# EAGLE schematic MD201x_2019-02-01 (EAGLE 9.4.2)

## Sheet 1 of 4
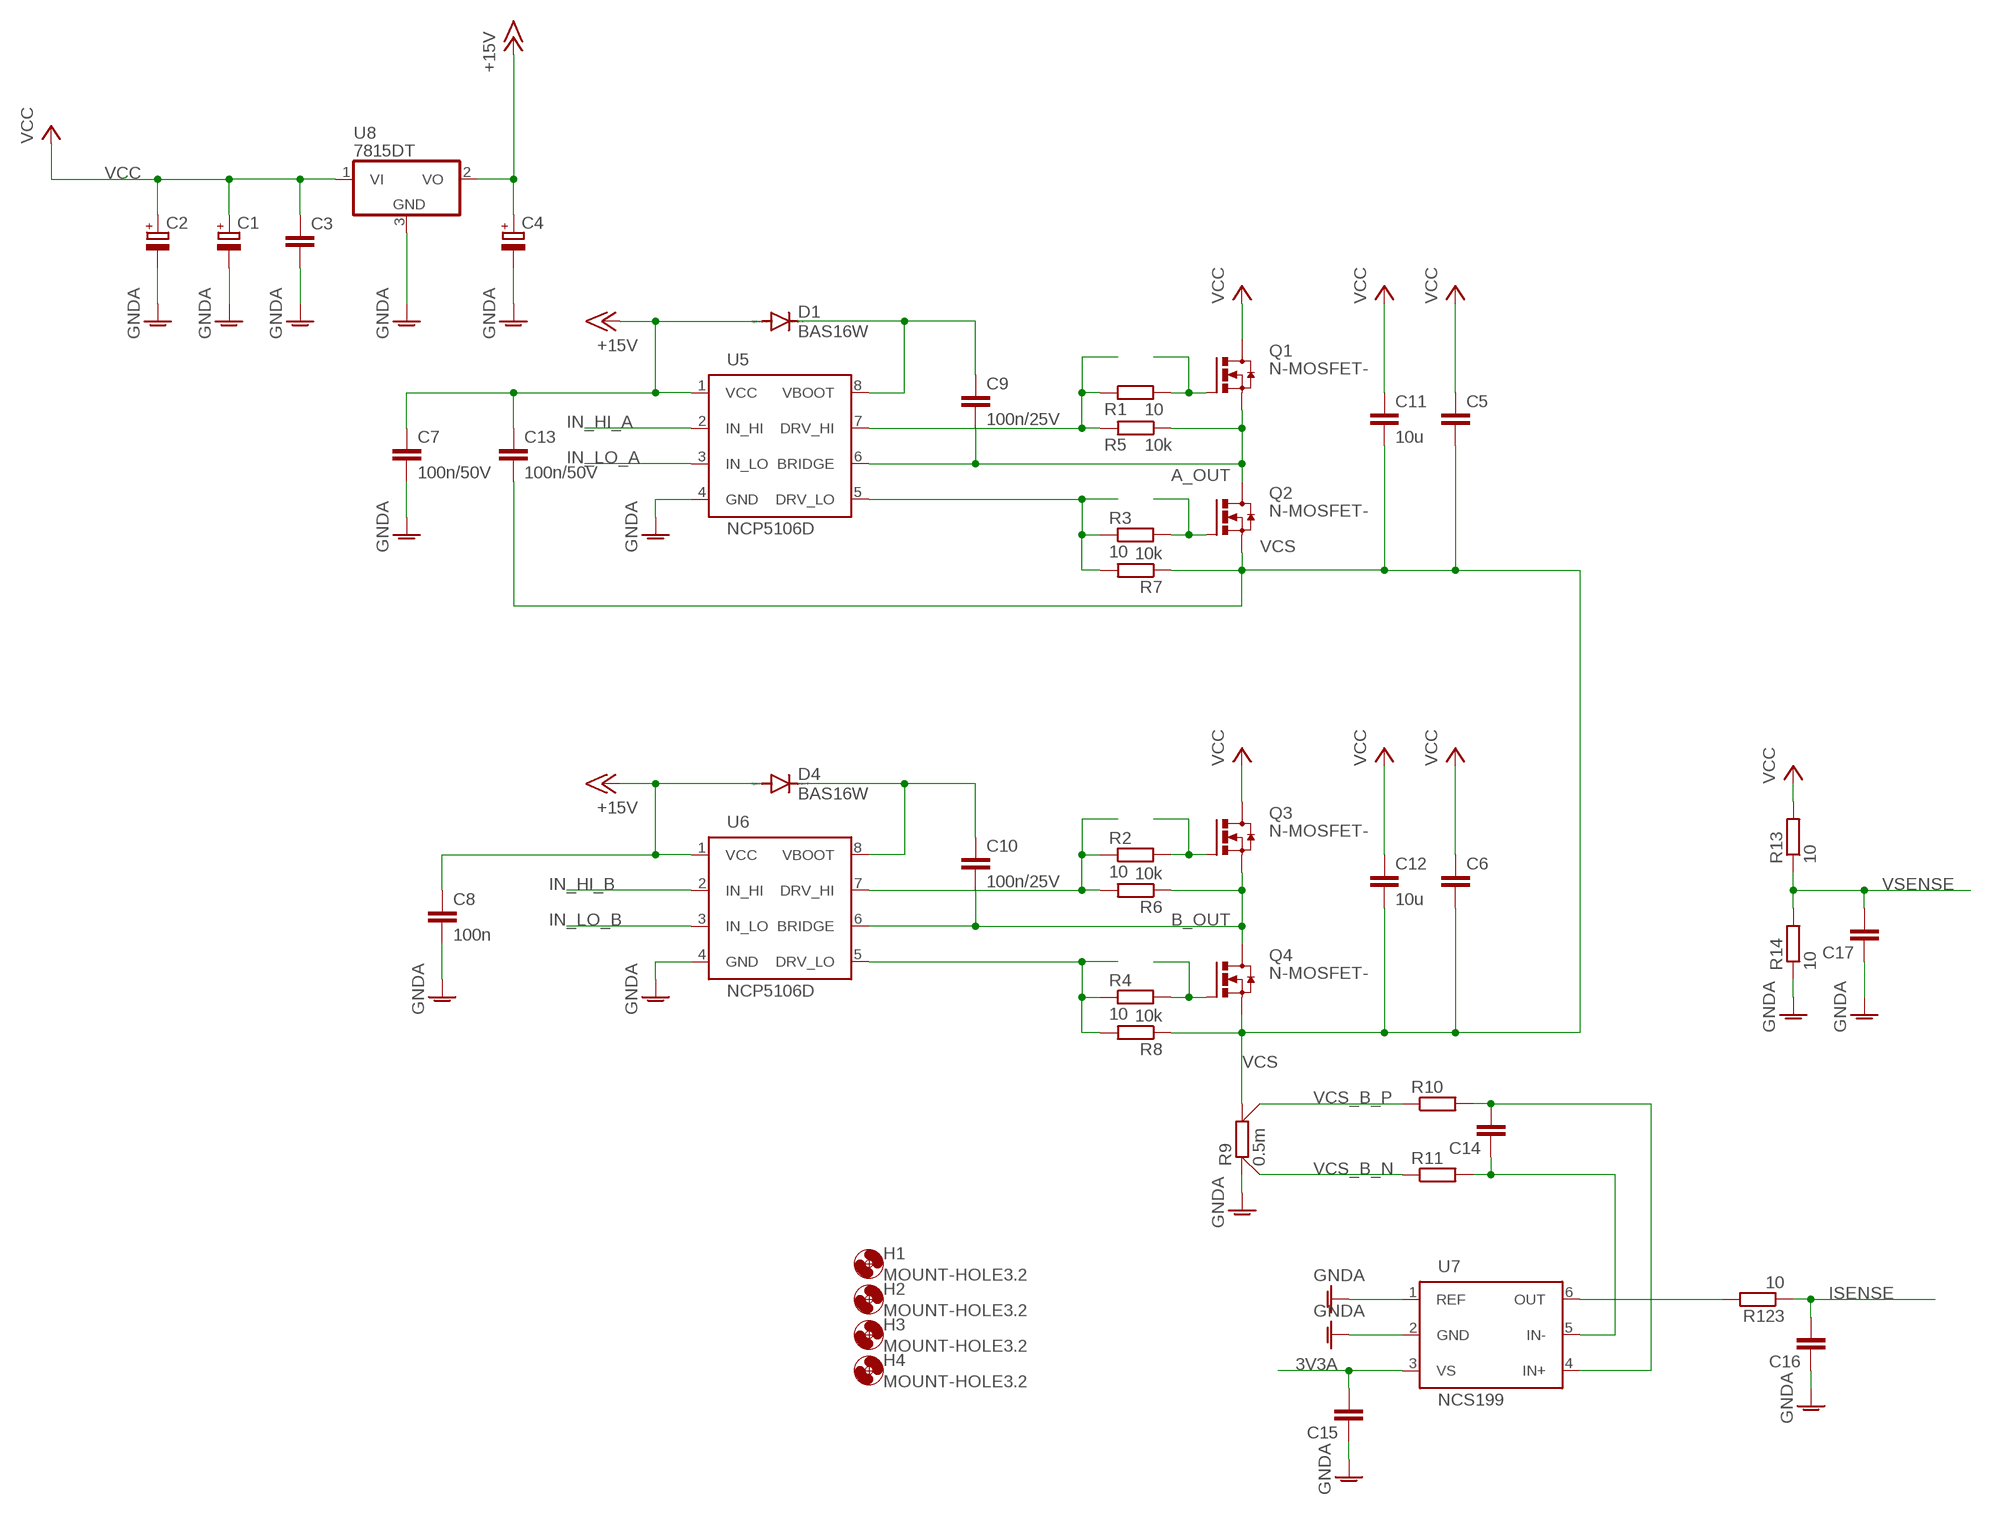
[diagram p0: schematic, sheet 1]

### Parts
C1  CPOL-EUE5-10.5  [E5-10,5]
C2  CPOL-EUE5-10.5  [E5-10,5]
C3  C-EUC0603  [C0603]
C4  CPOL-EUE2.5-5  [E2,5-5]
C5  C-EUC0603  [C0603]
C6  C-EUC0603  [C0603]
C7  100n/50V  C-EUC0603  [C0603]
C8  100n  C-EUC0603  [C0603]
C9  100n/25V  C-EUC0603  [C0603]
C10  100n/25V  C-EUC0603  [C0603]
C11  10u  C-EUC1210  [C1210]
C12  10u  C-EUC1210  [C1210]
C13  100n/50V  C-EUC0603  [C0603]
C14  C-EUC0603  [C0603]
C15  C-EUC0603  [C0603]
C16  C-EUC0603  [C0603]
C17  C-EUC0603  [C0603]
D1  BAS16W  DIODE-SOD323-R  [SOD323-R]
D4  BAS16W  DIODE-SOD323-R  [SOD323-R]
H1  MOUNT-HOLE3.2  [3,2]
H2  MOUNT-HOLE3.2  [3,2]
H3  MOUNT-HOLE3.2  [3,2]
H4  MOUNT-HOLE3.2  [3,2]
Q1  N-MOSFET-  [SOT669]
Q2  N-MOSFET-  [SOT669]
Q3  N-MOSFET-  [SOT669]
Q4  N-MOSFET-  [SOT669]
R1  10  R-EU_R0603  [R0603]
R2  10  R-EU_R0603  [R0603]
R3  10  R-EU_R0603  [R0603]
R4  10  R-EU_R0603  [R0603]
R5  10k  R-EU_R0603  [R0603]
R6  10k  R-EU_R0603  [R0603]
R7  10k  R-EU_R0603  [R0603]
R8  10k  R-EU_R0603  [R0603]
R9  0.5m  CSS2H-2512  [CSS2H-2512]
R10  R-EU_R0603  [R0603]
R11  R-EU_R0603  [R0603]
R13  10  R-EU_R0603  [R0603]
R14  10  R-EU_R0603  [R0603]
R123  10  R-EU_R0603  [R0603]
U5  NCP5106D  [SOIC127P600X175-8]
U6  NCP5106D  [SOIC127P600X175-8]
U7  NCS199  [SOT65P210X110-6]
U8  7815DT  [TO252]

### Nets
3V3A: C15.2 U7.3(VS) ; also sheet 3
+15V: C4.+ C7.1 C8.1 C13.1 D1.A D4.A U5.1(VCC) U6.1(VCC) U8.2(VO) ; also sheet 4
A_OUT: C9.2 Q1.1(SOURCE) Q1.2(SOURCE) Q1.3(SOURCE) Q2.5(DRAIN) R5.1 U5.6(BRIDGE)
B_OUT: C10.2 Q3.1(SOURCE) Q3.2(SOURCE) Q3.3(SOURCE) Q4.5(DRAIN) R6.1 U6.6(BRIDGE)
GNDA: C1.- C2.- C3.2 C4.- C7.2 C8.2 C15.1 C16.1 C17.1 R9.1$1 R9.1$2 R14.1 U5.4(GND) U6.4(GND) U7.1(REF) U7.2(GND) U8.3(GND) ; also sheet 2,3,4
IN_HI_A: U5.2(IN_HI) ; also sheet 3
IN_HI_B: U6.2(IN_HI) ; also sheet 3
IN_LO_A: U5.3(IN_LO) ; also sheet 3
IN_LO_B: U6.3(IN_LO) ; also sheet 3
ISENSE: C16.2 R123.1 ; also sheet 3
N$1: R1.1 R5.2 U5.7(DRV_HI)
N$2: R2.1 R6.2 U6.7(DRV_HI)
N$4: Q1.4(GATE) R1.2
N$5: R4.1 R8.2 U6.5(DRV_LO)
N$6: R123.2 U7.6(OUT)
N$11: R3.1 R7.2 U5.5(DRV_LO)
N$13: Q3.4(GATE) R2.2
N$36: C14.2 R10.2 U7.4(IN+)
N$37: C14.1 R11.2 U7.5(IN-)
N$61: Q2.4(GATE) R3.2
N$64: Q4.4(GATE) R4.2
N$67: C10.1 D4.C U6.8(VBOOT)
N$73: C9.1 D1.C U5.8(VBOOT)
VCC: C1.+ C2.+ C3.1 C5.1 C6.1 C11.1 C12.1 Q1.5(DRAIN) Q3.5(DRAIN) R13.2 U8.1(VI)
VCS: C5.2 C6.2 C11.2 C12.2 C13.2 Q2.1(SOURCE) Q2.2(SOURCE) Q2.3(SOURCE) Q4.1(SOURCE) Q4.2(SOURCE) Q4.3(SOURCE) R7.1 R8.1 R9.2$1 R9.2$2
VCS_B_N: R9.1S R11.1
VCS_B_P: R9.2S R10.1
VSENSE: C17.2 R13.1 R14.2 ; also sheet 3

## Sheet 2 of 4
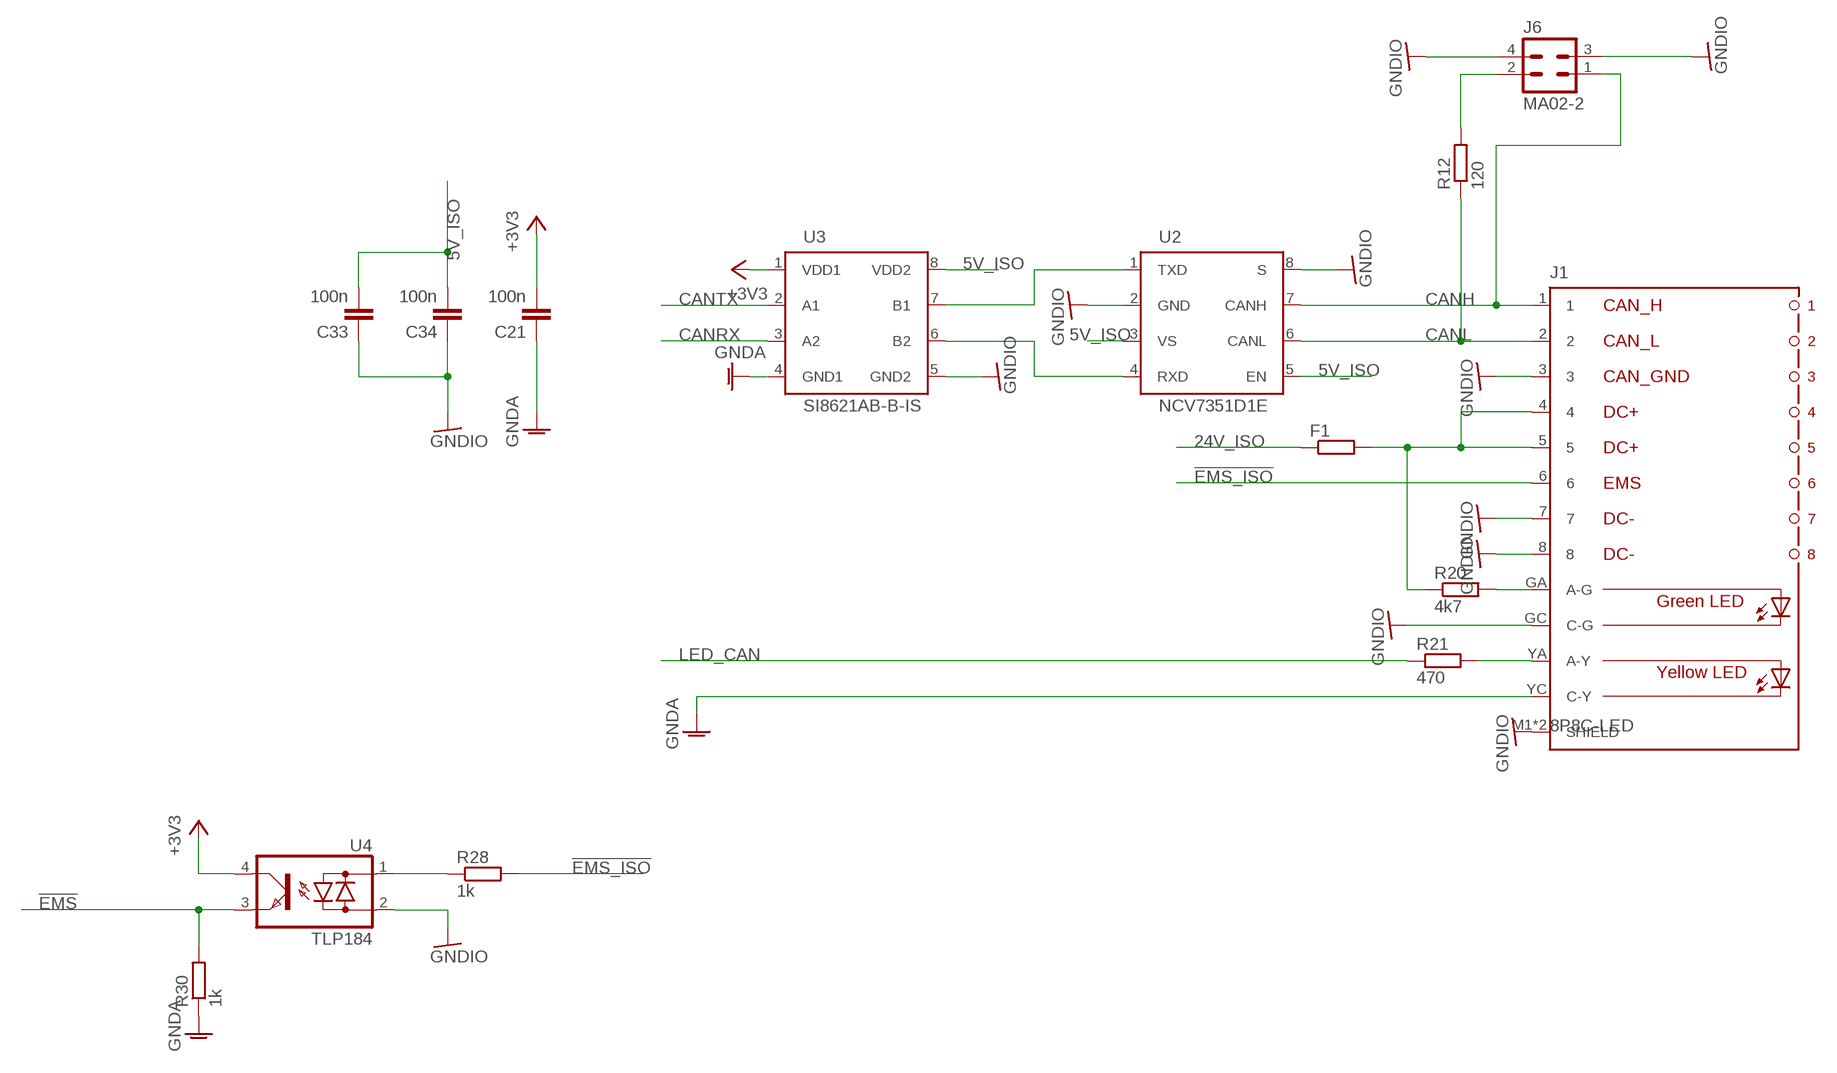
[diagram p1: schematic, sheet 2]

### Parts
C21  100n  C-EUC0603  [C0603]
C33  100n  C-EUC0805  [C0805]
C34  100n  C-EUC0603  [C0603]
F1  R-EU_R1206  [R1206]
J1  8P8C-LED  [8P8C-LED]
J6  MA02-2  [MA02-2W]
R12  120  R-EU_R0603  [R0603]
R20  4k7  R-EU_R0603  [R0603]
R21  470  R-EU_R0603  [R0603]
R28  1k  R-EU_R0603  [R0603]
R30  1k  R-EU_R0603  [R0603]
U2  NCV7351D1E  [SO08]
U3  SI8621AB-B-IS  [SO08]
U4  TLP184  [11-4M1S]

### Nets
5V_ISO: C33.2 C34.2 U2.3(VS) U2.5(EN) U3.8(VDD2) ; also sheet 4
24V_ISO: F1.1 ; also sheet 4
!EMS: R30.2 U4.3(E) ; also sheet 3
!EMS_ISO: J1.6 R28.2
+3V3: C21.2 U3.1(VDD1) U4.4(C) ; also sheet 3,4
CANH: J1.1 J6.1 U2.7(CANH)
CANL: J1.2 R12.1 U2.6(CANL)
CANRX: U3.3(A2) ; also sheet 3
CANTX: U3.2(A1) ; also sheet 3
GNDA: C21.1 J1.YC(C-Y) R30.1 U3.4(GND1) ; also sheet 1,3,4
GNDIO: C33.1 C34.1 J1.3 J1.7 J1.8 J1.GC(C-G) J1.M1(SHIELD) J1.M2(SHIELD) J6.3 J6.4 U2.2(GND) U2.8(S) U3.5(GND2) U4.2(AC2) ; also sheet 4
LED_CAN: R21.1 ; also sheet 3
N$8: F1.2 J1.4 J1.5 R20.1
N$9: J6.2 R12.2
N$18: J1.GA(A-G) R20.2
N$20: J1.YA(A-Y) R21.2
N$23: U2.1(TXD) U3.7(B1)
N$27: U2.4(RXD) U3.6(B2)
N$30: R28.1 U4.1(AC1)

## Sheet 3 of 4
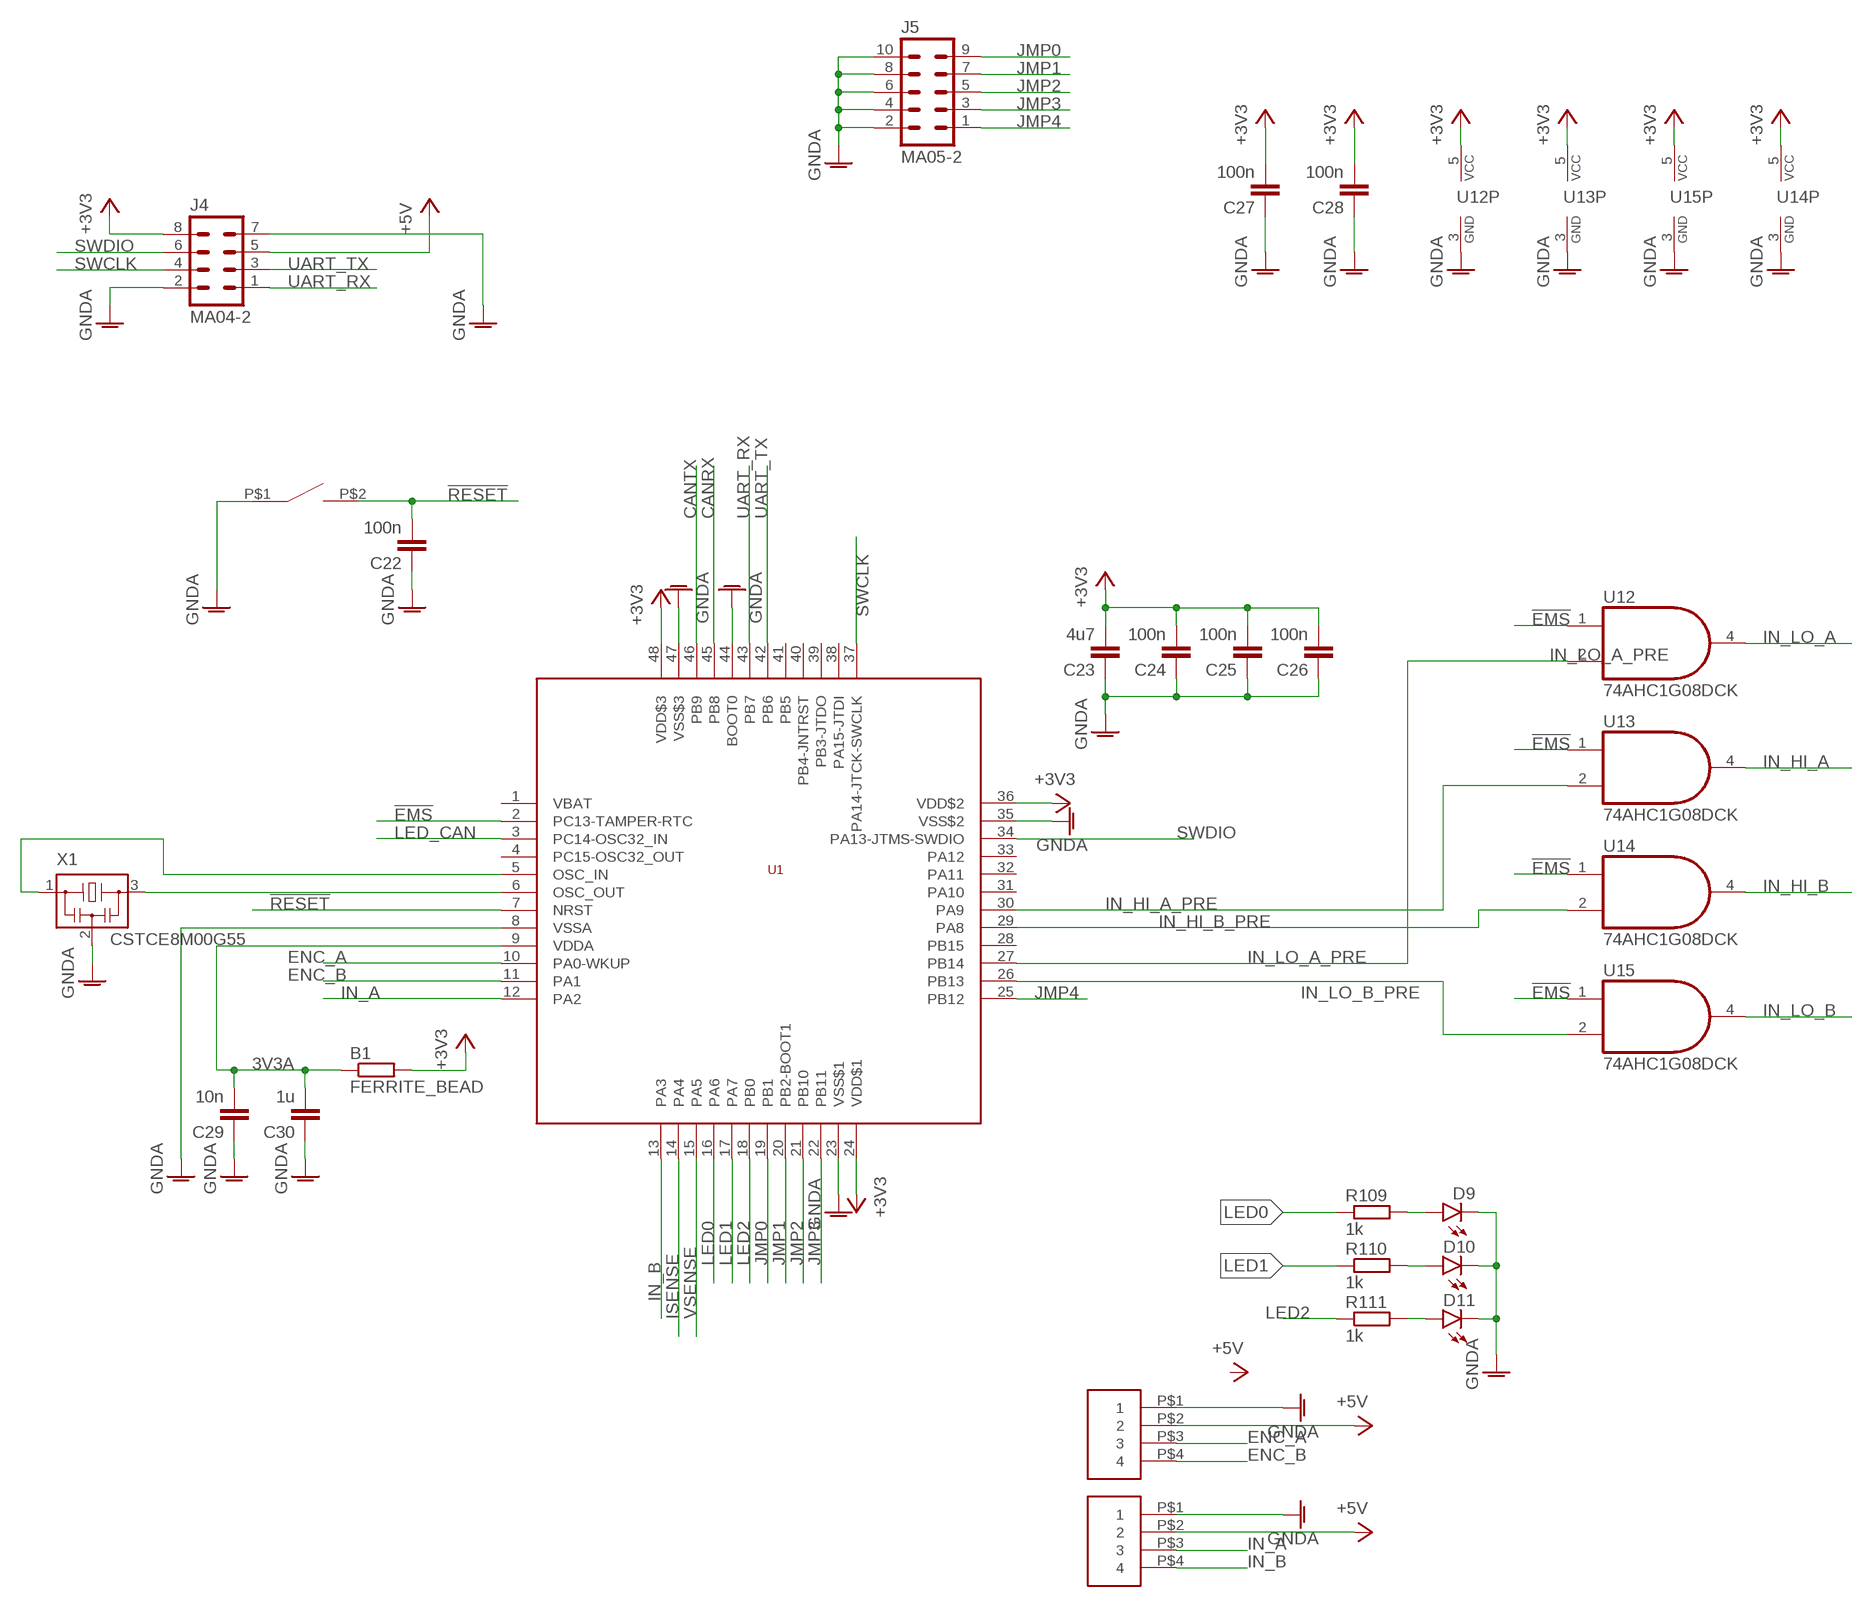
[diagram p2: schematic, sheet 3]

### Parts
B1  FERRITE_BEAD  R-EU_R0603  [R0603]
C22  100n  C-EUC0603  [C0603]
C23  4u7  C-EUC0805  [C0805]
C24  100n  C-EUC0603  [C0603]
C25  100n  C-EUC0603  [C0603]
C26  100n  C-EUC0603  [C0603]
C27  100n  C-EUC0603  [C0603]
C28  100n  C-EUC0603  [C0603]
C29  10n  C-EUC0603  [C0603]
C30  1u  C-EUC0603  [C0603]
D9  LEDCHIPLED_0805  [CHIPLED_0805]
D10  LEDCHIPLED_0805  [CHIPLED_0805]
D11  LEDCHIPLED_0805  [CHIPLED_0805]
J2  XH-4-SIDE  [CON-XH-4-SIDE]
J3  XH-4-SIDE  [CON-XH-4-SIDE]
J4  MA04-2  [MA04-2W]
J5  MA05-2  [MA05-2W]
R109  1k  R-EU_R0603  [R0603]
R110  1k  R-EU_R0603  [R0603]
R111  1k  R-EU_R0603  [R0603]
S1  SWITCH_TACTILETOP  [SWITCH_TACTILE_3X6]
U1  STM32F103C8  [LQFP48]
U12  74AHC1G08DCK  [SC70-5]
U13  74AHC1G08DCK  [SC70-5]
U14  74AHC1G08DCK  [SC70-5]
U15  74AHC1G08DCK  [SC70-5]
X1  CSTCE8M00G55  [CSTCE8M00G55]

### Nets
3V3A: B1.1 C29.2 C30.2 U1.9(VDDA) ; also sheet 1
!EMS: U1.2(PC13-TAMPER-RTC) U12.1(I0) U13.1(I0) U14.1(I0) U15.1(I0) ; also sheet 2
!RESET: C22.2 S1.P$2 U1.7(NRST)
+3V3: B1.2 C23.2 C24.2 C25.2 C26.2 C27.2 C28.2 J4.8 U1.24(VDD$1) U1.36(VDD$2) U1.48(VDD$3) U12.5(VCC) U13.5(VCC) U14.5(VCC) U15.5(VCC) ; also sheet 2,4
+5V: J2.P$2 J3.P$2 J4.5 ; also sheet 4
CANRX: U1.45(PB8) ; also sheet 2
CANTX: U1.46(PB9) ; also sheet 2
ENC_A: J2.P$3 U1.10(PA0-WKUP)
ENC_B: J2.P$4 U1.11(PA1)
GNDA: C22.1 C23.1 C24.1 C25.1 C26.1 C27.1 C28.1 C29.1 C30.1 D9.C D10.C D11.C J2.P$1 J3.P$1 J4.2 J4.7 J5.2 J5.4 J5.6 J5.8 J5.10 S1.P$1 U1.8(VSSA) U1.23(VSS$1) U1.35(VSS$2) U1.44(BOOT0) U1.47(VSS$3) U12.3(GND) U13.3(GND) U14.3(GND) U15.3(GND) X1.2 ; also sheet 1,2,4
IN_A: J3.P$3 U1.12(PA2)
IN_B: J3.P$4 U1.13(PA3)
IN_HI_A: U13.4(O) ; also sheet 1
IN_HI_A_PRE: U1.30(PA9) U13.2(I1)
IN_HI_B: U14.4(O) ; also sheet 1
IN_HI_B_PRE: U1.29(PA8) U14.2(I1)
IN_LO_A: U12.4(O) ; also sheet 1
IN_LO_A_PRE: U1.27(PB14) U12.2(I1)
IN_LO_B: U15.4(O) ; also sheet 1
IN_LO_B_PRE: U1.26(PB13) U15.2(I1)
ISENSE: U1.14(PA4) ; also sheet 1
JMP0: J5.9 U1.19(PB1)
JMP1: J5.7 U1.20(PB2-BOOT1)
JMP2: J5.5 U1.21(PB10)
JMP3: J5.3 U1.22(PB11)
JMP4: J5.1 U1.25(PB12)
LED0: R109.1 U1.16(PA6)
LED1: R110.1 U1.17(PA7)
LED2: R111.1 U1.18(PB0)
LED_CAN: U1.3(PC14-OSC32_IN) ; also sheet 2
N$3: D10.A R110.2
N$7: D9.A R109.2
N$10: U1.6(OSC_OUT) X1.3
N$19: U1.5(OSC_IN) X1.1
N$21: D11.A R111.2
SWCLK: J4.4 U1.37(PA14-JTCK-SWCLK)
SWDIO: J4.6 U1.34(PA13-JTMS-SWDIO)
UART_RX: J4.1 U1.43(PB7)
UART_TX: J4.3 U1.42(PB6)
VSENSE: U1.15(PA5) ; also sheet 1
Unconnected: U1.1(VBAT) U1.4(PC15-OSC32_OUT) U1.28(PB15) U1.31(PA10) U1.32(PA11) U1.33(PA12) U1.38(PA15-JTDI) U1.39(PB3-JTDO) U1.40(PB4-JNTRST) U1.41(PB5)

## Sheet 4 of 4
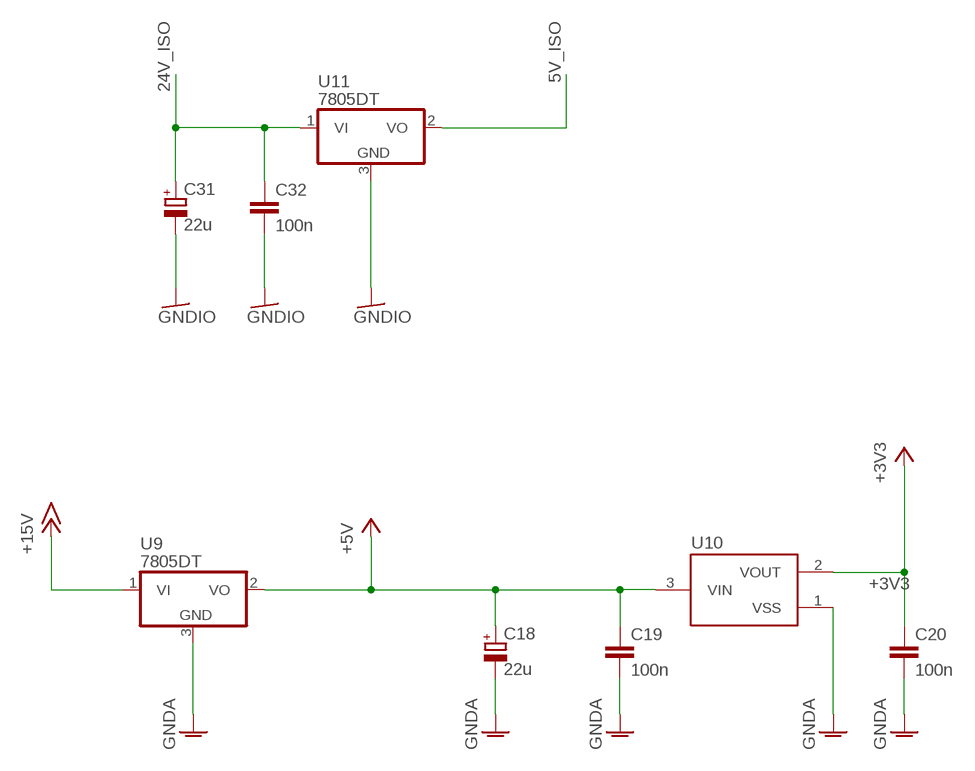
[diagram p3: schematic, sheet 4]

### Parts
C18  22u  CPOL-EUE2.5-5  [E2,5-5]
C19  100n  C-EUC0603  [C0603]
C20  100n  C-EUC0603  [C0603]
C31  22u  CPOL-EUE2.5-5  [E2,5-5]
C32  100n  C-EUC0603  [C0603]
U9  7805DT  [TO252]
U10  XC6206  [SOT95P240X110-3]
U11  7805DT  [TO252]

### Nets
5V_ISO: U11.2(VO) ; also sheet 2
24V_ISO: C31.+ C32.1 U11.1(VI) ; also sheet 2
+3V3: C20.1 U10.2(VOUT) ; also sheet 2,3
+5V: C18.+ C19.1 U9.2(VO) U10.3(VIN) ; also sheet 3
+15V: U9.1(VI) ; also sheet 1
GNDA: C18.- C19.2 C20.2 U9.3(GND) U10.1(VSS) ; also sheet 1,2,3
GNDIO: C31.- C32.2 U11.3(GND) ; also sheet 2

## Library data of the parts
B1 R1-R8 R13 R14 R109-R111 R123 = rcl:R-EU_: RESISTOR, European symbol
C1 C2 C4 C18 C31 = rcl:CPOL-EU: POLARIZED CAPACITOR, European symbol
C3 C5-C13 C19-C30 C32-C34 = rcl:C-EU: CAPACITOR, European symbol
C14-C17 = rcl:C-EU: CAPACITOR, European symbol; SPICEPREFIX: C
D1 D4 = diode:DIODE-: DIODE
D9-D11 = led:LED: LED OSRAM: - CHIPLED LG R971, LG N971, LY N971, LG Q971, LY Q971, LO R971, LY R971 LH N974, LH R974 LS Q976, LO Q976, LY Q976 LO Q996 - Hyper CHIPLED LW Q18S LB Q993, LB Q99A, LB R99A - SideLED LS A670, LO A670, LY A670, LG A670, LP A670 LB A673, LV A673, LT A673, LW A673 LH A674 LY A675 LS A676, LA A676, LO A676, LY A676, LW A676 LS A679, LY A679, LG A679 - Hyper Micro SIDELED® LS Y876, LA Y876, LO Y876, LY Y876 LT Y87S - SmartLED LW L88C, LW L88S LB L89C, LB L89S, LG L890 LS L89K, LO L89K, LY L89K LS L896, LA L896, LO L896, LY L896 - TOPLED LS T670, LO T670, LY T670, LG T670, LP T670 LSG T670, LSP T670, LSY T670, LOP T670, LYG T670 LG T671, LOG T671, LSG T671 LB T673, LV T673, LT T673, LW T673 LH T674 LS T676, LA T676, LO T676, LY T676, LB T676, LH T676, LSB T676, LW T676 LB T67C, LV T67C, LT T67C, LS T67K, LO T67K, LY T67K, LW E67C LS E67B, LA E67B, LO E67B, LY E67B, LB E67C, LV E67C, LT E67C LW T67C LS T679, LY T679, LG T679 LS T770, LO T770, LY T770, LG T770, LP T770 LB T773, LV T773, LT T773, LW T773 LH T774 LS E675, LA E675, LY E675, LS T675 LS T776, LA T776, LO T776, LY T776, LB T776 LHGB T686 LT T68C, LB T68C - Hyper Mini TOPLED® LB M676 - Mini TOPLED Santana® LG M470 LS M47K, LO M47K, LY M47K Source: http://www.osram.convergy.de LUXEON: - LUMILED® LXK2-PW12-R00, LXK2-PW12-S00, LXK2-PW14-U00, LXK2-PW14-V00 LXK2-PM12-R00, LXK2-PM12-S00, LXK2-PM14-U00 LXK2-PE12-Q00, LXK2-PE12-R00, LXK2-PE12-S00, LXK2-PE14-T00, LXK2-PE14-U00 LXK2-PB12-K00, LXK2-PB12-L00, LXK2-PB12-M00, LXK2-PB14-N00, LXK2-PB14-P00, LXK2-PB14-Q00 LXK2-PR12-L00, LXK2-PR12-M00, LXK2-PR14-Q00, LXK2-PR14-R00 LXK2-PD12-Q00, LXK2-PD12-R00, LXK2-PD12-S00 LXK2-PH12-R00, LXK2-PH12-S00 LXK2-PL12-P00, LXK2-PL12-Q00, LXK2-PL12-R00 Source: www.luxeon.com KINGBRIGHT: KA-3528ASYC Source: www.kingbright.com
F1 R10-R12 R20 R21 R28 R30 = rcl:R-EU_: RESISTOR, European symbol; SPICEPREFIX: R
H1-H4 = holes:MOUNT-HOLE: MOUNTING HOLE with drill center marker
J1 = con-rj45:8P8C-LED: generic 8P8C connector with two LED's; OC_FARNELL: unknown; OC_NEWARK: unknown
J2 J3 = con-xh:XH-4-SIDE
J4 = con-headers:MA04-2
J5 = con-headers:MA05-2
J6 = con-headers:MA02-2
Q1-Q4 = nexperia:N-MOSFET-*
R9 = r_shunt:CSS2H-2512: Bourns Model CSS2H-2512 Series Current Sense Resistor <https://www.bourns.com/docs/Product-Datasheets/css2h-2512.pdf>
S1 = switch-tactile:SWITCH_TACTILE
U1 = stm32_mcu:STM32F103C8: STMicroelectronics STM32F103C8 Mainstream Performance line, ARM Cortex-M3 MCU with 64 Kbytes Flash, 72 MHz CPU, motor control, USB and CAN references: datasheet <https://www.st.com/resource/en/datasheet/stm32f103c8.pdf> product page <https://www.st.com/ja/microcontrollers/stm32f103c8.html>
U2 = on-semi:NCV7351D1E: High Speed CAN Transceiver Source: NCV7351-D.PDF <http://www.onsemi.com/PowerSolutions/document/NCV7351-D.PDF>
U3 = silabs:SI8621AB-B-IS: 1 Mbps Digital Isolator 1 Mbps, 2.5 kVRMS Digital Isolator Source: Si86xx.pdf <https://www.silabs.com/documents/public/data-sheets/Si86xx.pdf>
U4 = md201x:TLP184
U5 U6 = on-semi:NCP5106
U7 = on-semi:NCS199
U8 U9 U11 = linear:78*: Positive VOLTAGE REGULATOR Source: http://cache.national.com/ds/LM/LM78L05.pdf http://www.fairchildsemi.com/ds/LM/LM7805.pdf
U10 = torex:XC6206
U12-U15 = 74xx-little-us:74*1G08: 2-input AND gate
X1 = resonator:CSTCE8M00G55

## Net classes
1 current_sense: width 0.254 mm